# Altium schematic sheet Timer_Sheet.SchDoc
size A3
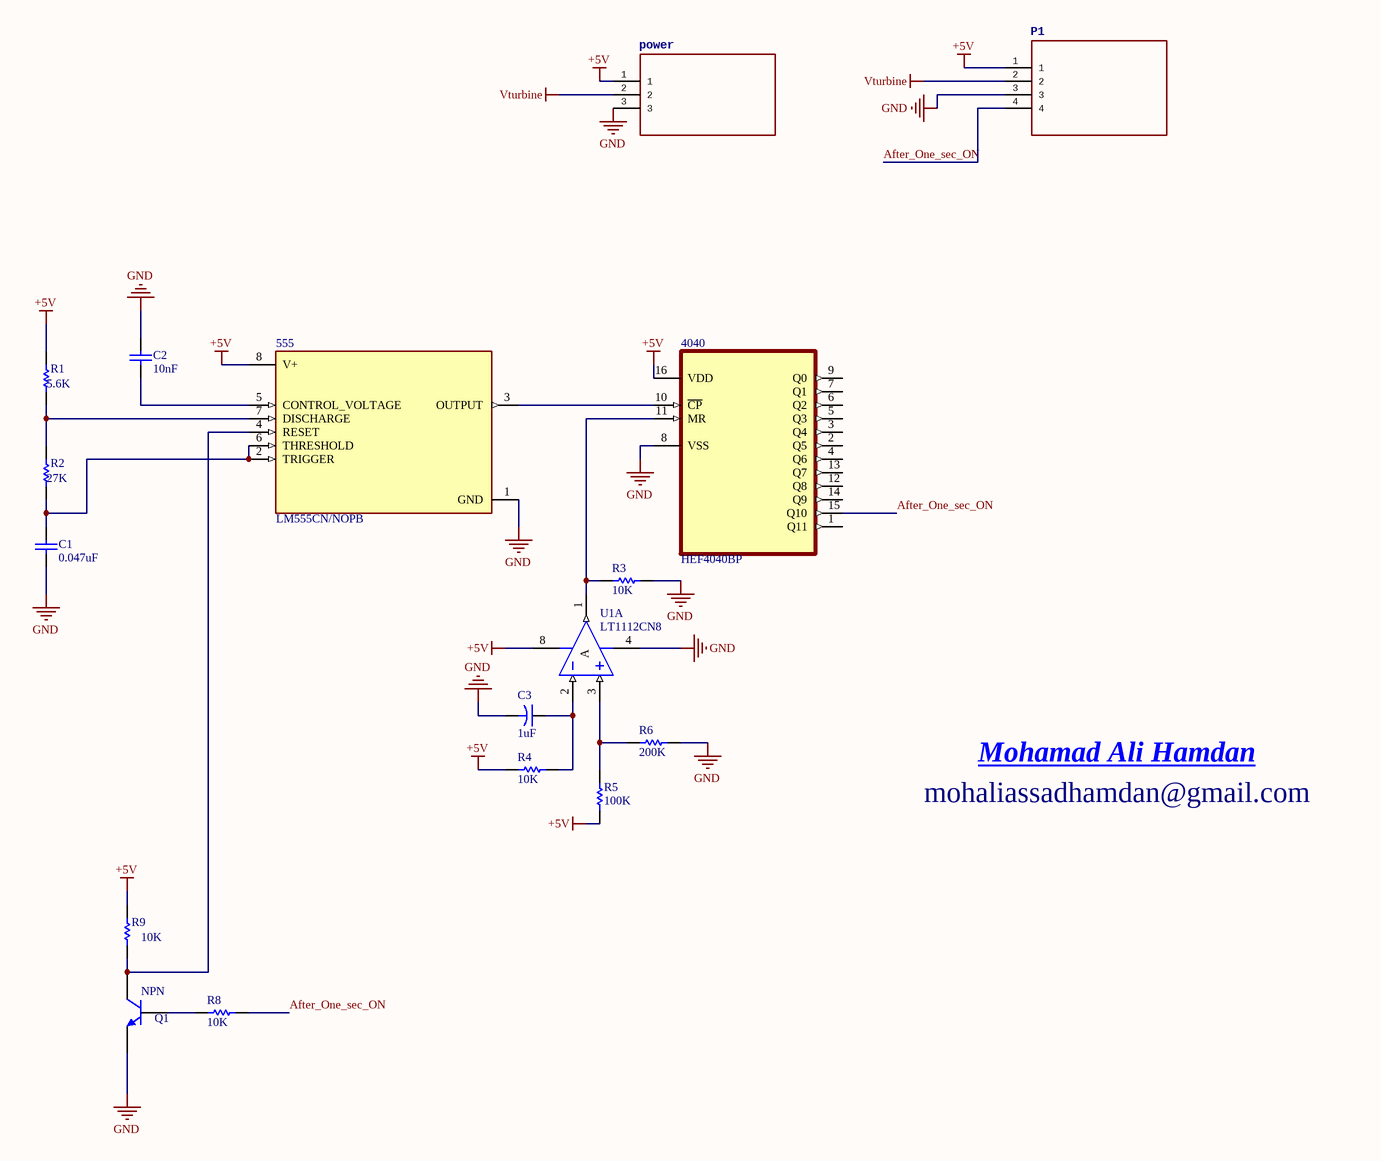
[diagram p0: Timer_Sheet.SchDoc]

## Parts
555  LM555CN/NOPB  [DIP794W45P254L959H508Q8]
4040  HEF4040BP  [DIP254P762X420-16]
C1  value 0.047uF  [CAP_RDER71H333K0M1H03A]  (hidden comment: Cap)
C2  value 10nF  [CAP_RDER71H333K0M1H03A]  (hidden comment: Cap)
C3  value 1uF  [Capacitor_polarized_100uF]  (hidden comment: Cap2)
P1  SAMTEC-HTSW-104-14-X-SJ  [SAMTEC-HTSW-104-14-X-S]  (value not drawn)
power  SAMTEC-HTSW-103-07-X-SJ  [SAMTEC-HTSW-103-07-X-S]  (value not drawn)
Q1  NPN  [TO-226-AA]
R1  value 5.6K  [resistor]  (hidden comment: Res1)
R2  value 27K  [resistor]  (hidden comment: Res1)
R3  value 10K  [resistor]  (hidden comment: Res1)
R4  value 10K  [resistor]  (hidden comment: Res1)
R5  value 100K  [resistor]  (hidden comment: Res1)
R6  value 200K  [resistor]  (hidden comment: Res1)
R8  value 10K  [resistor]  (hidden comment: Res1)
R9  value 10K  [resistor]  (hidden comment: Res1)
U1  LT1112CN8  [DIP794W45P254L959H508Q8]  (part A of 2)

## Nets
+5V: 555.8(V+) 4040.16(VDD) P1.1 power.1 R1.2 R4.1 R5.1 R9.2 U1.8(V+)
GND: 555.1(GND) 4040.8(VSS) C1.2 C2.1 C3.2 P1.3 power.3 Q1.3(E) R3.2 R6.2 U1.4(V-)
Vturbine: P1.2 power.2
After_One_sec_ON: 4040.15(Q10) P1.4 R8.2
Net555_2: 555.2(TRIGGER) 555.6(THRESHOLD) C1.1 R2.1
Net555_3: 555.3(OUTPUT) 4040.10(~{CP})
Net555_4: 555.4(RESET) Q1.1(C) R9.1
Net555_5: 555.5(CONTROL_VOLTAGE) C2.2
Net555_7: 555.7(DISCHARGE) R1.1 R2.2
Net4040_11: 4040.11(MR) R3.1 U1.1(OUT)
NetC3_1: C3.1 R4.2 U1.2(IN-)
NetQ1_2: Q1.2(B) R8.1
NetR5_2: R5.2 R6.1 U1.3(IN+)

Not connected (* = marked no-connect by the designer): 4040 1(Q11) 2(Q5) 3(Q4) 4(Q6) 5(Q3) 6(Q2) 7(Q1) 9(Q0) 12(Q8) 13(Q7) 14(Q9)

## Notes on the sheet
- mohaliassadhamdan@gmail.com
- Mohamad Ali Hamdan
- (in symbol LT1112CN8, part A) A

## Library data of the parts
4040 = HEF4040BP: Counter IC Binary Counter 1 Element 12 Bit Negative Edge 16-DIP; MF: NXP USA; Package: PDIP-16 NXP Semiconductors; MP: HEF4040BP; Price: None; Availability: Bad; Value: *; Check_prices: https://www.snapeda.com/parts/HEF4040BP/NXP%20USA%20Inc./view-part/568595/?ref=eda; SnapEDA_Link: https://www.snapeda.com/parts/HEF4040BP/NXP%20USA%20Inc./view-part/568595/?ref=snap
C1 C2 = Cap: Capacitor; Published: 8-Jun-2000; LatestRevisionDate: 17-Jul-2002; LatestRevisionNote: Re-released for DXP Platform.; PackageReference: RAD-0.3; Publisher: Altium Limited; PackageDescription: Radial Cap, Thru-Hole; 2 Leads; 0.3 in Pin Spacing
C3 = Cap2: Capacitor; pin to pad: 1>+ 2>-; Published: 23-Sep-2002; PackageReference: CAPR5-4X5; Publisher: Altium Limited; PackageDescription: Capacitor; 2 Leads
Q1 = NPN: NPN Bipolar Transistor; Published: 8-Jun-2000; LatestRevisionDate: 17-Jul-2002; LatestRevisionNote: Re-released for DXP Platform.; PackageReference: TO-226-AA; Publisher: Altium Limited; PackageDescription: TO, Flat Index; 3 In-Line, Axial Leads; Body Dia. 4.8mm; Leads 0.55 x 0.51 mm (max); Code_JEDEC: TO-226-AA
R1-R6 R8 R9 = Res1: Resistor; Published: 8-Jun-2000; LatestRevisionDate: 17-Jul-2002; LatestRevisionNote: Re-released for DXP Platform.; PackageReference: AXIAL-0.3; Publisher: Altium Limited; PackageDescription: Axial Device, Thru-Hole; 2 Leads; 0.3 in Pin Spacing
U1 = LT1112CN8: Dual Low Power Precision, Picoamp Input Operational Amplifier; Note: 453; Published: 8-Jun-2000; LatestRevisionDate: 29-May-2009; LatestRevisionNote: Component Body Added.; DatasheetVersion: 1996; PackageVersion: N8 1002; PackageReference: N8; Publisher: Altium Limited; PackageDescription: DIP, Plastic, 8-Pin, Row Spacing 7.62 mm, Pitch 2.54 mm; ComponentLink1Description: Manufacturer Link; ComponentLink1URL: http://www.linear.com/; ComponentLink2Description: Datasheet; ComponentLink2URL: http://www.linear.com/pc/downloadDocument.do?navId=H0,C1,C1154,C1009,C1100,P1365,D1714
555 = LM555CN/NOPB: Value: *; Availability: Unavailable; Package: None; MP: LM555CN/NOPB; Price: None